# Altium schematic sheet 04_CONNECTOR_IN.SchDoc
size 420 x 297 mm; SheetNumber: 5; SheetTotal: 24
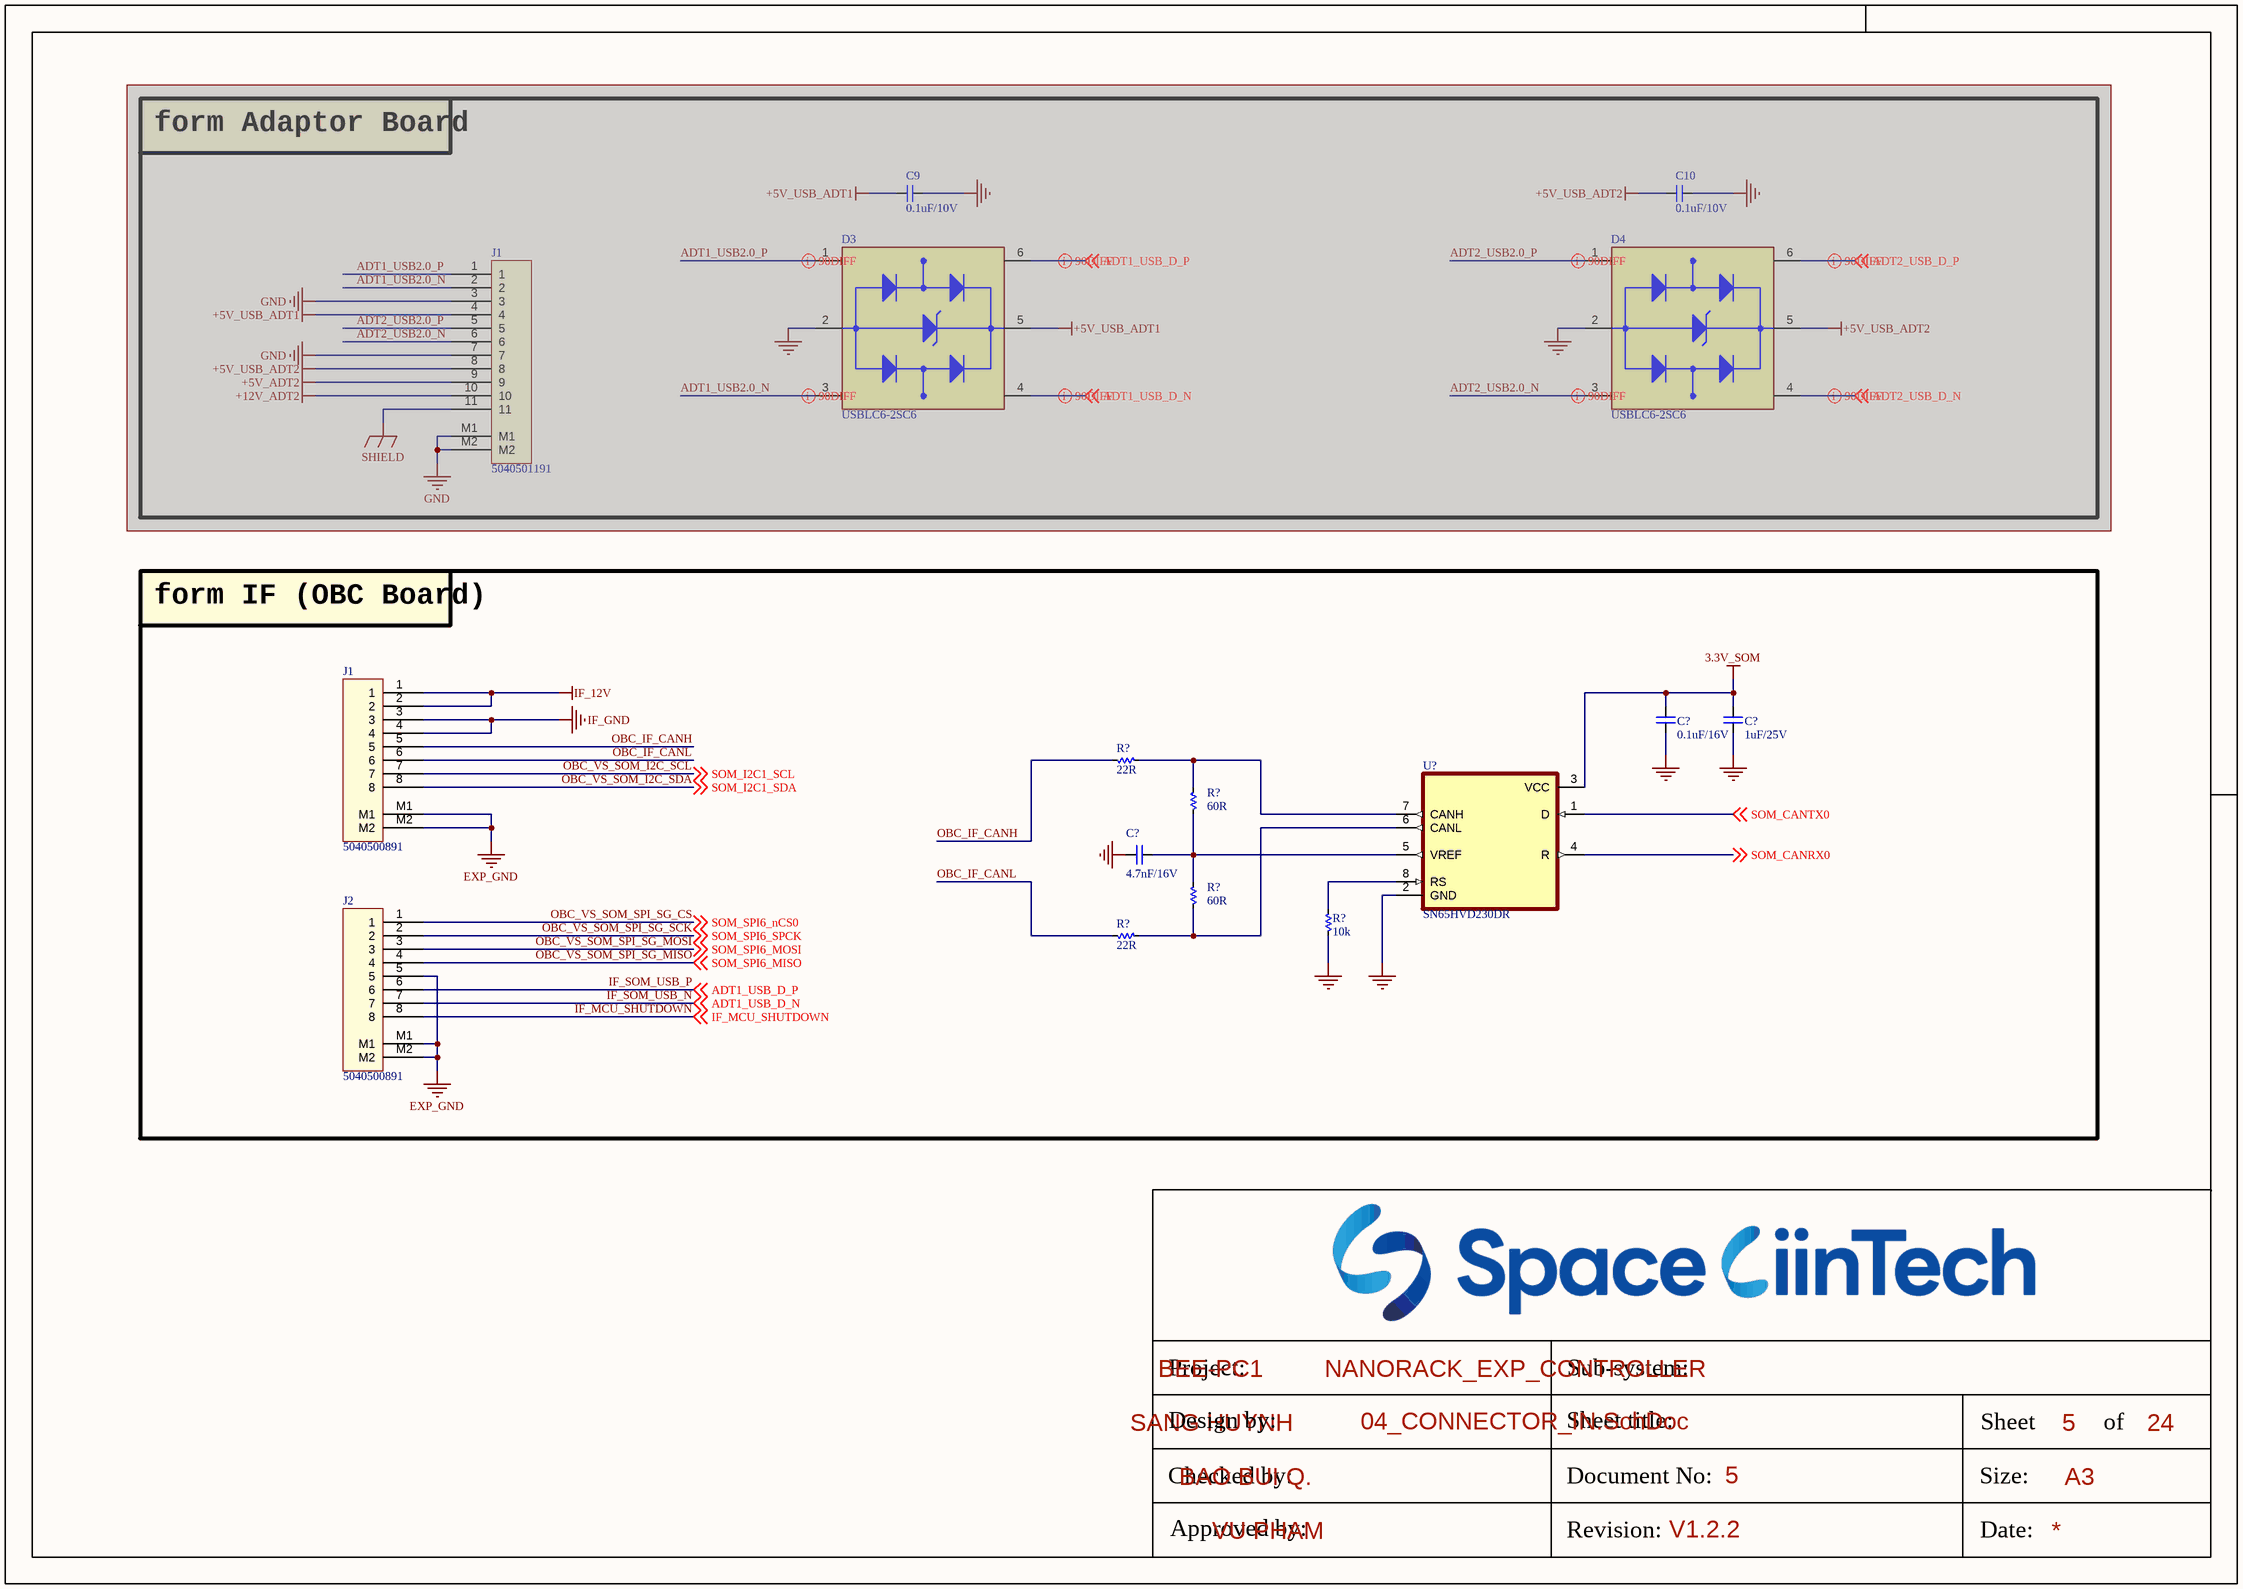
[diagram p0: 04_CONNECTOR_IN.SchDoc]

## Parts
(Parts that share a designator on the sheet are numbered #1, #2 ... from top to bottom, then left to right.)
C9  0.1uF/10V  [CAP_C_1005X60]  (masked out: inside a compile mask, not in the netlist)
C10  0.1uF/10V  [CAP_C_1005X60]  (masked out: inside a compile mask, not in the netlist)
C?#1  0.1uF/16V  [CAP_C_1608X80]
C?#2  1uF/25V  [CAP_C_1608X80]
C?#3  4.7nF/16V  [CAP_C_1608X80]
D3  USBLC6-2SC6  [SOT95P280X145-6N]  (masked out: inside a compile mask, not in the netlist)
D4  USBLC6-2SC6  [SOT95P280X145-6N]  (masked out: inside a compile mask, not in the netlist)
J1#1  5040501191  (masked out: inside a compile mask, not in the netlist)
J1#2  5040500891  [MOLEX_5040500891]
J2  5040500891  [MOLEX_5040500891]
R?#1  22R  [RES_C_1608X60]
R?#2  60R  [RES_C_1608X60]
R?#3  60R  [RES_C_1608X60]
R?#4  10k  [RES_C_1608X60]
R?#5  22R  [RES_C_1608X60]
U?  SN65HVD230DR  [SOIC127P599X175-8N]

## Blocks framed on the sheet
form Adaptor Board: C9 C10 D3 D4 J1#1
form IF (OBC Board): C?#1-C?#3 J1#2 J2 R?#1-R?#5 U?

## Nets
3.3V_SOM: C?#1.1 C?#2.1 U?.3(VCC)
EXP_GND: J1#2.M1 J1#2.M2 J2.5 J2.M1 J2.M2
GND: C?#1.2 C?#2.2 C?#3.2 R?#4.1 U?.2(GND)
IF_12V: J1#2.1 J1#2.2
IF_GND: J1#2.3 J1#2.4
IF_MCU_SHUTDOWN: J2.8 ; off-sheet IF_MCU_SHUTDOWN
IF_SOM_USB_N: J2.7 ; off-sheet ADT1_USB_D_N  [also labelled ADT1_USB_D_N]
IF_SOM_USB_P: J2.6 ; off-sheet ADT1_USB_D_P  [also labelled ADT1_USB_D_P]
OBC_IF_CANH: J1#2.5 R?#1.1
OBC_IF_CANL: J1#2.6 R?#5.1
OBC_VS_SOM_I2C_SCL: J1#2.7 ; off-sheet SOM_I2C1_SCL  [also labelled SOM_I2C1_SCL]
OBC_VS_SOM_I2C_SDA: J1#2.8 ; off-sheet SOM_I2C1_SDA  [also labelled SOM_I2C1_SDA]
OBC_VS_SOM_SPI_SG_CS: J2.1 ; off-sheet SOM_SPI6_nCS0  [also labelled SOM_SPI6_nCS0]
OBC_VS_SOM_SPI_SG_MISO: J2.4 ; off-sheet SOM_SPI6_MISO  [also labelled SOM_SPI6_MISO]
OBC_VS_SOM_SPI_SG_MOSI: J2.3 ; off-sheet SOM_SPI6_MOSI  [also labelled SOM_SPI6_MOSI]
OBC_VS_SOM_SPI_SG_SCK: J2.2 ; off-sheet SOM_SPI6_SPCK  [also labelled SOM_SPI6_SPCK]
SOM_CANRX0: U?.4(R) ; off-sheet SOM_CANRX0
SOM_CANTX0: U?.1(D) ; off-sheet SOM_CANTX0
NetC?#3_1: C?#3.1 R?#2.1 R?#3.2 U?.5(VREF)
NetR?#1_2: R?#1.2 R?#2.2 U?.7(CANH)
NetR?#3_1: R?#3.1 R?#5.2 U?.6(CANL)
NetR?#4_2: R?#4.2 U?.8(RS)

## Layout directives
differential pair; differential pair class DIFF90: (no net found under the mark)

## Notes on the sheet
- Project:
- BEE-PC1
- Sub-system:
- NANORACK_EXP_CONTROLLER
- Design by:
- SANG HUYNH
- BAO BUI Q.
- Sheet title:
- Sheet
- A3
- of
- Checked by:
- Approved by:
- VU PHAM
- Revision:
- Document No:
- V1.2.2
- Size:
- Date:

## Library data of the parts
C9 C10 = _CAP_C_2: CAP CHIP
C?#1-C?#3 = CAP_SMD: CAP_Chip; Value: 33pF
D3 D4 = USBLC6-2SC6: 17V Clamp 5A (8/20Âµs) Ipp Tvs Diode Surface Mount SOT-23-6; MF: STMicroelectronics; Value: *; SnapEDA_Link: https://www.snapeda.com/parts/USBLC6-2SC6/STMicroelectronics/view-part/?ref=snap; Check_prices: https://www.snapeda.com/parts/USBLC6-2SC6/STMicroelectronics/view-part/?ref=eda; Purchase-URL: https://pricing.snapeda.com/search/part/USBLC6-2SC6/?ref=eda; Price: None; Availability: In Stock; Package: SOT-23-6 STMicroelectronics; MP: USBLC6-2SC6
J1#1 = Header 11x1_2M
J1#2 J2 = Header 8x1_2M
R?#1-R?#5 = _RES_B_2: RES
U? = SN65HVD230DR: 3.3 V CAN Transceiver with Standby Mode; MF: Texas Instruments; SnapEDA_Link: https://www.snapeda.com/parts/SN65HVD230DR/Texas+Instruments/view-part/?ref=snap; Package: SOIC-8 Texas Instruments; Value: *; MP: SN65HVD230DR; Check_prices: https://www.snapeda.com/parts/SN65HVD230DR/Texas+Instruments/view-part/?ref=eda